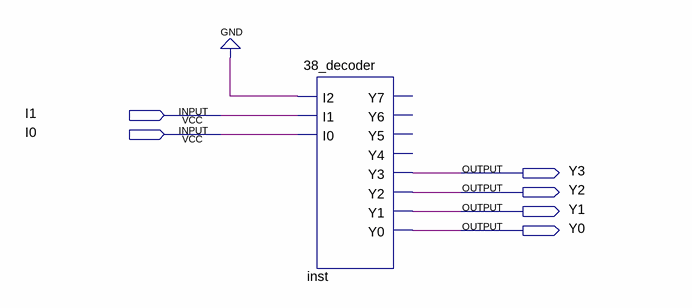
[diagram p0: schematic sheet]
// Quartus schematic 24_decoder.bdf as structural Verilog: 1 symbols, 6 pins
module \24_decoder  (
  input  I1,
  input  I0,
  output Y3,
  output Y2,
  output Y1,
  output Y0
);

  \38_decoder  inst (.I2(1'b0), .I1(I1), .I0(I0), .Y3(Y3), .Y2(Y2), .Y1(Y1), .Y0(Y0));  // open: Y7, Y6, Y5, Y4
endmodule
